# EasyEDA schematic 1-Schematic_business_card_v1.json
TITLE: Sheet_1; REV: 1.0; Date: 2020-11-05; Sheet: 1/1; Drawn By: maxim.zabarka; Company: Your Company
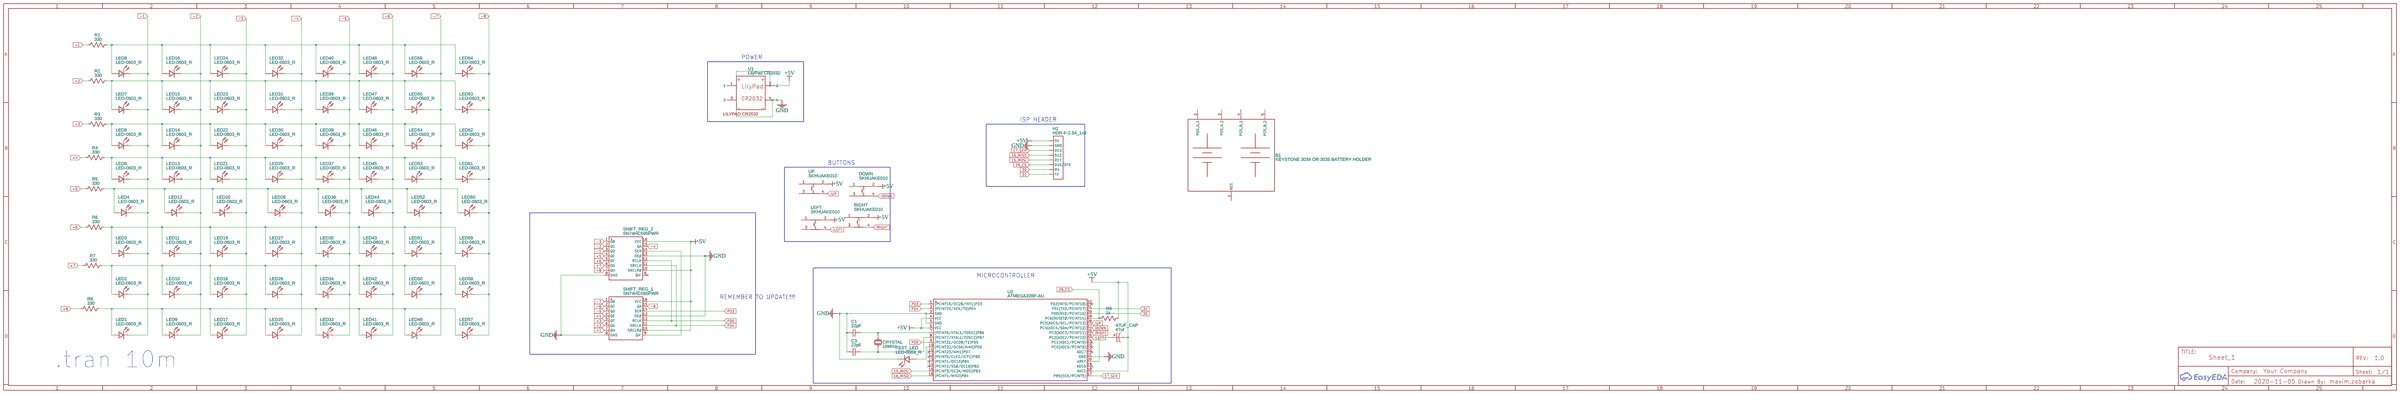
[diagram p0: schematic sheet]

## Parts
47UF_CAP  47uf  [CASE-A_3216]
B1  KEYSTONE 3034 OR 3035 BATTERY HOLDER  [KEYSTONE 3034 OR 3035 BATTERY HOLDER]
C1  22pF  [C1206]
C3  22pF  [C1206]
CRYSTAL  16MHz  [HC-49S_L11.4-W4.8]
DOWN  SKHUAKE010  [SW-SMD_4P-L6.2-W6.3-P4.00-LS6.8]
H2  HDR-F-2.54_1x8  [HDR-F-2.54_1X8]
LED1  LED-0603_R  [LED0603_RED]
LED2  LED-0603_R  [LED0603_RED]
LED3  LED-0603_R  [LED0603_RED]
LED4  LED-0603_R  [LED0603_RED]
LED5  LED-0603_R  [LED0603_RED]
LED6  LED-0603_R  [LED0603_RED]
LED7  LED-0603_R  [LED0603_RED]
LED8  LED-0603_R  [LED0603_RED]
LED9  LED-0603_R  [LED0603_RED]
LED10  LED-0603_R  [LED0603_RED]
LED11  LED-0603_R  [LED0603_RED]
LED12  LED-0603_R  [LED0603_RED]
LED13  LED-0603_R  [LED0603_RED]
LED14  LED-0603_R  [LED0603_RED]
LED15  LED-0603_R  [LED0603_RED]
LED16  LED-0603_R  [LED0603_RED]
LED17  LED-0603_R  [LED0603_RED]
LED18  LED-0603_R  [LED0603_RED]
LED19  LED-0603_R  [LED0603_RED]
LED20  LED-0603_R  [LED0603_RED]
LED21  LED-0603_R  [LED0603_RED]
LED22  LED-0603_R  [LED0603_RED]
LED23  LED-0603_R  [LED0603_RED]
LED24  LED-0603_R  [LED0603_RED]
LED25  LED-0603_R  [LED0603_RED]
LED26  LED-0603_R  [LED0603_RED]
LED27  LED-0603_R  [LED0603_RED]
LED28  LED-0603_R  [LED0603_RED]
LED29  LED-0603_R  [LED0603_RED]
LED30  LED-0603_R  [LED0603_RED]
LED31  LED-0603_R  [LED0603_RED]
LED32  LED-0603_R  [LED0603_RED]
LED33  LED-0603_R  [LED0603_RED]
LED34  LED-0603_R  [LED0603_RED]
LED35  LED-0603_R  [LED0603_RED]
LED36  LED-0603_R  [LED0603_RED]
LED37  LED-0603_R  [LED0603_RED]
LED38  LED-0603_R  [LED0603_RED]
LED39  LED-0603_R  [LED0603_RED]
LED40  LED-0603_R  [LED0603_RED]
LED41  LED-0603_R  [LED0603_RED]
LED42  LED-0603_R  [LED0603_RED]
LED43  LED-0603_R  [LED0603_RED]
LED44  LED-0603_R  [LED0603_RED]
LED45  LED-0603_R  [LED0603_RED]
LED46  LED-0603_R  [LED0603_RED]
LED47  LED-0603_R  [LED0603_RED]
LED48  LED-0603_R  [LED0603_RED]
LED49  LED-0603_R  [LED0603_RED]
LED50  LED-0603_R  [LED0603_RED]
LED51  LED-0603_R  [LED0603_RED]
LED52  LED-0603_R  [LED0603_RED]
LED53  LED-0603_R  [LED0603_RED]
LED54  LED-0603_R  [LED0603_RED]
LED55  LED-0603_R  [LED0603_RED]
LED56  LED-0603_R  [LED0603_RED]
LED57  LED-0603_R  [LED0603_RED]
LED58  LED-0603_R  [LED0603_RED]
LED59  LED-0603_R  [LED0603_RED]
LED60  LED-0603_R  [LED0603_RED]
LED61  LED-0603_R  [LED0603_RED]
LED62  LED-0603_R  [LED0603_RED]
LED63  LED-0603_R  [LED0603_RED]
LED64  LED-0603_R  [LED0603_RED]
LEFT  SKHUAKE010  [SW-SMD_4P-L6.2-W6.3-P4.00-LS6.8]
R1  330  [R0603]
R2  330  [R0603]
R3  330  [R0603]
R4  330  [R0603]
R5  330  [R0603]
R6  330  [R0603]
R7  330  [R0603]
R8  330  [R0603]
R9  1k  [R0603]
RIGHT  SKHUAKE010  [SW-SMD_4P-L6.2-W6.3-P4.00-LS6.8]
SHIFT_REG_1  SN74HC595PWR  [TSSOP-16_L5.0-W4.4-P0.65-LS6.4-BL]
SHIFT_REG_2  SN74HC595PWR  [TSSOP-16_L5.0-W4.4-P0.65-LS6.4-BL]
TEST_LED  LED-0603_R  [LED0603_RED]
U1  LilyPad CR2032  [LILYPAD CR2032]
U2  ATMEGA328P-AU  [TQFP-32_L7.0-W7.0-P0.80-LS9.0-BL]
UP  SKHUAKE010  [SW-SMD_4P-L6.2-W6.3-P4.00-LS6.8]

## Library data of the parts
47UF_CAP = C_Tan_SMD_A_US: Contributor: LCEDA_Lib
B1 = KEYSTONE 3034 OR 3035 BATTERY HOLDER: Contributor: stevendavidforbes
C1 C3 = CC1206JKNPOCBN220: Supplier: LCSC; Manufacturer: YAGEO; Supplier Part: C107174
CRYSTAL = C16000J119: Supplier: LCSC; Supplier Part: C259047; Manufacturer: ZheJiang East Crystal Elec; Contributor: LCSC
DOWN LEFT RIGHT UP = SKHUAKE010: Supplier: LCSC; Supplier Part: C262397; Manufacturer: ALPS Electric; Contributor: LCSC
H2 = HDR-F-2.54_1x8: Supplier Part: C225505; Supplier: LCSC; Contributor: LCEDA_Lib
LED1-LED64 TEST_LED = LED-0603_R: Manufacturer: EVERLIGHT(台湾亿光); Manufacturer Part: 19-217/R6C-AL1M2VY/3T; Supplier Part: C72044; Supplier: LCSC; Contributor: LCEDA_01
R1-R9 = R_0603_US: Contributor: LCEDA_Lib
SHIFT_REG_1 SHIFT_REG_2 = SN74HC595PWR: Supplier: LCSC; Supplier Part: C273642; Manufacturer: Texas Instruments; Contributor: LCSC; LCSC Assembly: Yes; SMT Type: Extend
U1 = LilyPad CR2032: Contributor: basuradepapel1; Package Display: Yes
U2 = ATMEGA328P-AU: Supplier: LCSC; Manufacturer: MICROCHIP; image: //image.lceda.cn/szlcsc/C14877.jpg; Supplier Part: C14877; LCSC Assembly: Yes; SMT Type: Basic; Package Display: No

## Nets
+5V: 47UF_CAP.2 DOWN.2 H2.1(5V) LEFT.2 R9.2 RIGHT.2 SHIFT_REG_1.10(SRCLR#) SHIFT_REG_1.16(VCC) SHIFT_REG_2.10(SRCLR#) SHIFT_REG_2.16(VCC) U1.1 U1.2 U2.4(VCC) U2.6(VCC) U2.18(AVCC) UP.2
GND: C1.1 C3.1 H2.2(GND) SHIFT_REG_1.8(GND) SHIFT_REG_1.13(OE#) SHIFT_REG_2.8(GND) SHIFT_REG_2.13(OE#) TEST_LED.2 U1.3 U1.4 U2.3(GND) U2.5(GND) U2.21(GND)
15_MOSI: H2.5(D11) U2.15((PCINT3/OC2A/MOSI)PB3)
16_MISO: H2.4(D12) U2.16((PCINT4/MISO)PB4)
17_SCK: H2.3(D13) U2.17(PB5(SCK/PCINT5))
29_CS: H2.6(D10/DTR) R9.1 U2.29(PC6(RESET#/PCINT14))
30: H2.7(RX) U2.30(PD0(RXD/PCINT16))
31: H2.8(TX) U2.31(PD1(TXD/PCINT17))
+1: R1.2 SHIFT_REG_1.7(QH)
+2: R2.1 SHIFT_REG_1.6(QG)
+3: R3.2 SHIFT_REG_1.5(QF)
+4: R4.2 SHIFT_REG_1.4(QE)
+5: R5.2 SHIFT_REG_2.4(QE)
+6: R6.2 SHIFT_REG_2.5(QF)
+7: R7.2 SHIFT_REG_2.6(QG)
+8: R8.2 SHIFT_REG_2.7(QH)
-1: LED1.2 LED2.2 LED3.2 LED4.2 LED5.2 LED6.2 LED7.2 LED8.2 SHIFT_REG_2.3(QD)
-2: LED9.2 LED10.2 LED11.2 LED12.2 LED13.2 LED14.2 LED15.2 LED16.2 SHIFT_REG_2.2(QC)
-3: LED17.2 LED18.2 LED19.2 LED20.2 LED21.2 LED22.2 LED23.2 LED24.2 SHIFT_REG_2.1(QB)
-4: LED25.2 LED26.2 LED27.2 LED28.2 LED29.2 LED30.2 LED31.2 LED32.2 SHIFT_REG_2.15(QA)
-5: LED33.2 LED34.2 LED35.2 LED36.2 LED37.2 LED38.2 LED39.2 LED40.2 SHIFT_REG_1.3(QD)
-6: LED41.2 LED42.2 LED43.2 LED44.2 LED45.2 LED46.2 LED47.2 LED48.2 SHIFT_REG_1.2(QC)
-7: LED49.2 LED50.2 LED51.2 LED52.2 LED53.2 LED54.2 LED55.2 LED56.2 SHIFT_REG_1.1(QB)
-8: LED57.2 LED58.2 LED59.2 LED60.2 LED61.2 LED62.2 LED63.2 LED64.2 SHIFT_REG_1.15(QA)
IDOWN: DOWN.4 U2.27(PC4(ADC4/SDA/PCINT12))
ILEFT: LEFT.4 U2.25(PC2(ADC2/PCINT10))
IRIGHT: RIGHT.4 U2.26(PC3(ADC3/PCINT11))
IUP: U2.28(PC5(ADC5/SCL/PCINT13)) UP.4
PD3: SHIFT_REG_1.14(SER) U2.1((PCINT19/OC2B/INT1)PD3)
PD4: SHIFT_REG_1.11(SRCLK) SHIFT_REG_2.11(SRCLK) U2.2((PCINT20/XCK/T0)PD4)
PD5: SHIFT_REG_1.12(RCLK) SHIFT_REG_2.12(RCLK) U2.9((PCINT21/OC0B/T1)PD5)
Net-(47UF_CAP-1): 47UF_CAP.1 U2.20(AREF)
Net-(C1-2): C1.2 CRYSTAL.1(OSC1) U2.7((PCINT6/XTAL1/TOSC1)PB6)
Net-(C3-2): C3.2 CRYSTAL.2(OSC2) U2.8((PCINT7/XTAL2/TOSC2)PB7)
Net-(LED1-1): LED1.1 LED9.1 LED17.1 LED25.1 LED33.1 LED41.1 LED49.1 LED57.1 R8.1
Net-(LED2-1): LED2.1 LED10.1 LED18.1 LED26.1 LED34.1 LED42.1 LED50.1 LED58.1 R7.1
Net-(LED3-1): LED3.1 LED11.1 LED19.1 LED27.1 LED35.1 LED43.1 LED51.1 LED59.1 R6.1
Net-(LED4-1): LED4.1 LED12.1 LED20.1 LED28.1 LED36.1 LED44.1 LED52.1 LED60.1 R5.1
Net-(LED5-1): LED5.1 LED13.1 LED21.1 LED29.1 LED37.1 LED45.1 LED53.1 LED61.1 R4.1
Net-(LED6-1): LED6.1 LED14.1 LED22.1 LED30.1 LED38.1 LED46.1 LED54.1 LED62.1 R3.1
Net-(LED7-1): LED7.1 LED15.1 LED23.1 LED31.1 LED39.1 LED47.1 LED55.1 LED63.1 R2.2
Net-(LED8-1): LED8.1 LED16.1 LED24.1 LED32.1 LED40.1 LED48.1 LED56.1 LED64.1 R1.1
Net-(SHIFT_REG_1-9): SHIFT_REG_1.9(QH') SHIFT_REG_2.14(SER)
Net-(TEST_LED-1): TEST_LED.1 U2.10((PCINT22/OC0A/AIN0)PD6)

Not connected (* = marked no-connect by the designer): B1 1(NEG) 2(POS_A_1) 3(POS_A_2) 4(POS_B_1) 5(POS_B_2); DOWN 1 3; LEFT 1 3; RIGHT 1 3; SHIFT_REG_2 9(QH')*; U2 11((PCINT23/AIN1)PD7)* 12((PCINT0/CLKO/ICP1)PB0)* 13((PCINT1/OC1A)PB1)* 14((PCINT2/SS#/OC1B)PB2)* 19(ADC6)* 22(ADC7)* 23(PC0(ADC0/PCINT8))* 24(PC1(ADC1/PCINT9))* 32(PD2(INT0/PCINT18))*; UP 1 3

## Notes on the sheet
- POWER
- ISP HEADER
- BUTTONS
- MICROCONTROLLER
- REMEMBER TO UPDATE!!!
- .tran 10m
